# EAGLE schematic untitled (EAGLE 9.3.0)
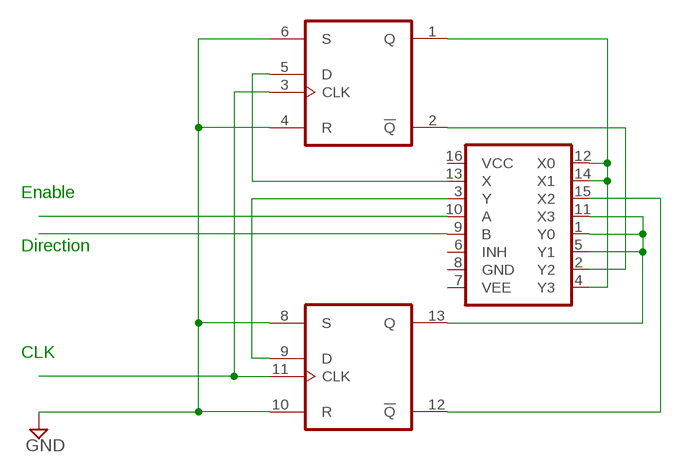
[diagram p0: schematic, sheet 1]

## Parts
U1  CD4013B  CD4013  [DIP14-KIT]
U2  74HC4052D  [SO16]

## Nets
GND: U1.4(R) U1.6(S) U1.8(S) U1.10(R)
N$1: U1.3(CLK) U1.11(CLK)
N$2: U2.10(A)
N$3: U2.9(B)
N$4: U1.1(Q) U2.4(Y3) U2.12(X0) U2.14(X1)
N$5: U1.2(!Q) U2.2(Y2)
N$6: U1.13(Q) U2.1(Y0) U2.5(Y1) U2.11(X3)
N$7: U1.5(D) U2.13(X)
N$8: U1.12(!Q) U2.15(X2)
N$9: U1.9(D) U2.3(Y)
Unconnected: U1.7(P$V-) U1.14(P$V+) U2.6(INH)

## Notes on the sheet
- Enable
- Direction
- CLK

## Power pins joined to a net without a drawn wire
GND: U2.8(GND)
VCC: U2.16(VCC)
VEE: U2.7(VEE)

## Library data of the parts
U1 = SparkFun-IC-Logic:CD4013: Dual D-type Flip-Flop Datasheet <https://cdn.sparkfun.com/datasheets/Kits/CD4013B.pdf> SparkFun Products SparkFun SparkPunk Sound Kit <https://www.sparkfun.com/products/11177> (KIT-11177) SparkFun SparkPunk Sequencer Kit <https://www.sparkfun.com/products/12707> (KIT-12707); PROD_ID: IC-11896
U2 = SparkFun-IC-Logic:74*4052: Dual 4:1 Analog Mux Dual four-channel analog MULTIPLEXER / DEMULTIPLEXER SparkFun Products SparkFun Vernier Interface Shield <https://www.sparkfun.com/products/12858> (DEV-12858); PROD_ID: IC-13103